# Altium project VENTUNOQ.PrjPcb (part 15 of 18)

## Sheet PCIE_NVME.SchDoc: PCIE_NVME
size A3; Author: Silvio Navaretti; CompanyName: ARDUINO; Organization: ARDUINO; SheetNumber: 27; SheetTotal: 51; RevAuthor: Silvio Navaretti
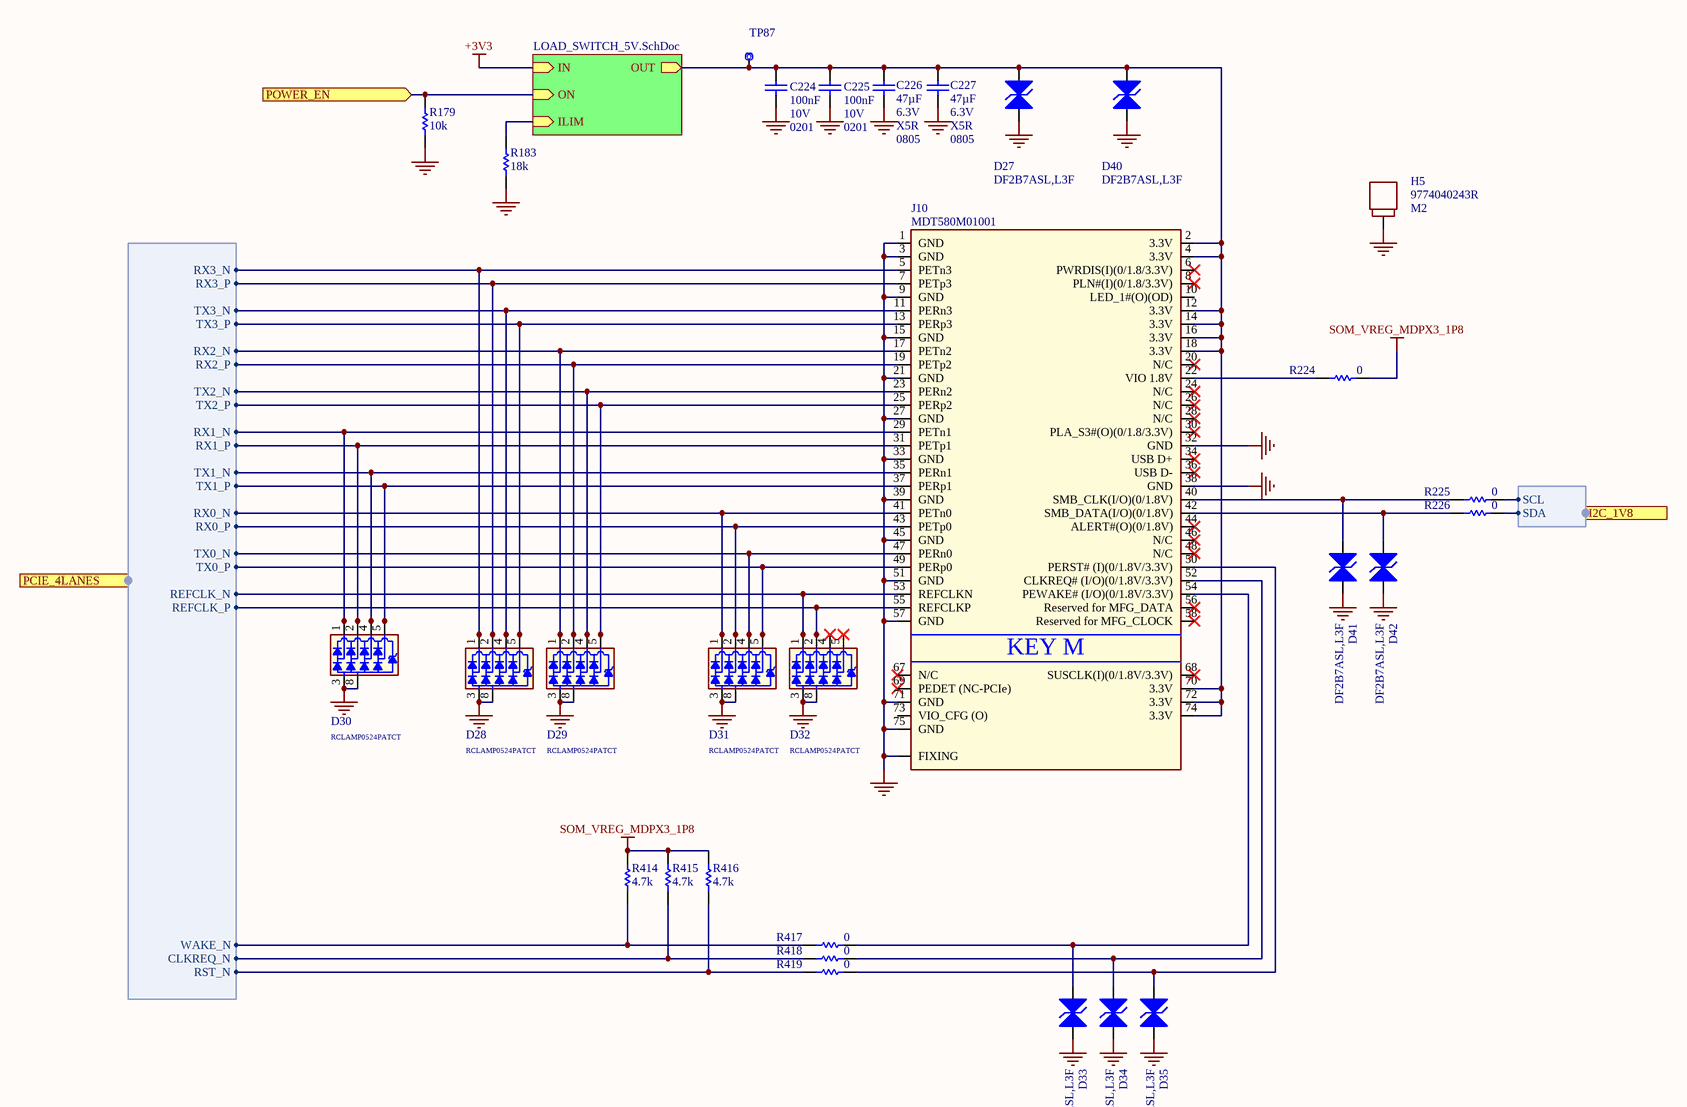
[diagram p48: PCIE_NVME.SchDoc]

### Parts
C224  value 100nF  Voltage: 10V  Case Code (Imperial): 0201  [CAP-0201]  (hidden comment: CL03A104KP3NNNC)
C225  value 100nF  Voltage: 10V  Case Code (Imperial): 0201  [CAP-0201]  (hidden comment: CL03A104KP3NNNC)
C226  value 47µF  Voltage: 6.3V  Dielectric: X5R  Case Code (Imperial): 0805  [CAP-0805]  (hidden comment: C0805C476M9PAC7800)
C227  value 47µF  Voltage: 6.3V  Dielectric: X5R  Case Code (Imperial): 0805  [CAP-0805]  (hidden comment: C0805C476M9PAC7800)
D27  DF2B7ASL,L3F  [DF2B7ASL,L3F]
D28  RCLAMP0524PATCT  [SLP2510P8]
D29  RCLAMP0524PATCT  [SLP2510P8]
D30  RCLAMP0524PATCT  [SLP2510P8]
D31  RCLAMP0524PATCT  [SLP2510P8]
D32  RCLAMP0524PATCT  [SLP2510P8]
D33  DF2B7ASL,L3F  [DF2B7ASL,L3F]
D34  DF2B7ASL,L3F  [DF2B7ASL,L3F]
D35  DF2B7ASL,L3F  [DF2B7ASL,L3F]
D40  DF2B7ASL,L3F  [DF2B7ASL,L3F]
D41  DF2B7ASL,L3F  [DF2B7ASL,L3F]
D42  DF2B7ASL,L3F  [DF2B7ASL,L3F]
H5  9774040243R  [9774040243R]
J10  MDT580M01001  [MDT580M01001]
R179  value 10k  [RES-0201]  (hidden comment: RC0201FR-0710KL)
R183  value 18k  [RES-0201]  (hidden comment: RC0201FR-0718KL)
R224  value 0  [RES-0201]  (hidden comment: CRCW02010000Z0ED)
R225  value 0  [RES-0201]  (hidden comment: CRCW02010000Z0ED)
R226  value 0  [RES-0201]  (hidden comment: CRCW02010000Z0ED)
R414  value 4.7k  [RES-0201]  (hidden comment: RC0201FR-074K7L)
R415  value 4.7k  [RES-0201]  (hidden comment: RC0201FR-074K7L)
R416  value 4.7k  [RES-0201]  (hidden comment: RC0201FR-074K7L)
R417  value 0  [RES-0201]  (hidden comment: CRCW02010000Z0ED)
R418  value 0  [RES-0201]  (hidden comment: CRCW02010000Z0ED)
R419  value 0  [RES-0201]  (hidden comment: CRCW02010000Z0ED)
TP87  Test point 1.00mm  [TP-1.00MM]  (value not drawn)  (no BOM)

### Sub-sheets
U_LOAD_SWITCH_5V = LOAD_SWITCH_5V.SchDoc: IN (in), OUT (out), ON (in), ILIM (in)

### Ports
I2C_1V8 (harness I2C), PCIE_4LANES (in, harness SOM_MD_PCIE1), POWER_EN (in)

### Harnesses
SOM_MD_PCIE1: RX0_N, RX0_P, TX0_P, TX0_N, RX1_N, RX1_P, TX1_P, TX1_N, REFCLK_N, REFCLK_P, RX2_N, RX2_P, TX2_P, TX2_N, RX3_N, RX3_P, TX3_P, TX3_N, WAKE_N, CLKREQ_N, RST_N
I2C: SDA, SCL

### Nets
GND: C224.1 C225.1 C226.1 C227.1 D27.1(A1) D28.3 D28.8 D29.3 D29.8 D30.3 D30.8 D31.3 D31.8 D32.3 D32.8 D33.1(A1) D34.1(A1) D35.1(A1) D40.1(A1) D41.1(A1) D42.1(A1) H5.1 J10.1(GND) J10.3(GND) J10.9(GND) J10.15(GND) J10.21(GND) J10.27(GND) J10.32(GND) J10.33(GND) J10.38(GND) J10.39(GND) J10.45(GND) J10.51(GND) J10.57(GND) J10.71(GND) J10.75(GND) J10.FIXING R179.1 R183.1
SOM_VREG_MDPX3_1P8: R224.1 R414.2 R415.2 R416.2
GPIO_21: R414.1 R417.2 ; port PCIE_4LANES.WAKE_N
GPIO_22: R415.1 R418.2 ; port PCIE_4LANES.CLKREQ_N
GPIO_23: R416.1 R419.2 ; port PCIE_4LANES.RST_N
MD_GPIO_29: R226.1 ; port I2C_1V8.SDA
MD_GPIO_30: R225.1 ; port I2C_1V8.SCL
MD_GPIO_51: R179.2 ; port POWER_EN, sheet U_LOAD_SWITCH_5V/ON
MD_PCIE1_4LANES.REFCLK_N: D32.1 D32.10 J10.53(REFCLKN) ; port PCIE_4LANES.REFCLK_N
MD_PCIE1_4LANES.REFCLK_P: D32.2 D32.9 J10.55(REFCLKP) ; port PCIE_4LANES.REFCLK_P
MD_PCIE1_4LANES.RX0_N: D31.1 D31.10 J10.41(PETn0) ; port PCIE_4LANES.RX0_N
MD_PCIE1_4LANES.RX0_P: D31.2 D31.9 J10.43(PETp0) ; port PCIE_4LANES.RX0_P
MD_PCIE1_4LANES.RX1_N: D30.1 D30.10 J10.29(PETn1) ; port PCIE_4LANES.RX1_N
MD_PCIE1_4LANES.RX1_P: D30.2 D30.9 J10.31(PETp1) ; port PCIE_4LANES.RX1_P
MD_PCIE1_4LANES.RX2_N: D29.1 D29.10 J10.17(PETn2) ; port PCIE_4LANES.RX2_N
MD_PCIE1_4LANES.RX2_P: D29.2 D29.9 J10.19(PETp2) ; port PCIE_4LANES.RX2_P
MD_PCIE1_4LANES.RX3_N: D28.1 D28.10 J10.5(PETn3) ; port PCIE_4LANES.RX3_N
MD_PCIE1_4LANES.RX3_P: D28.2 D28.9 J10.7(PETp3) ; port PCIE_4LANES.RX3_P
MD_PCIE1_4LANES.TX0_N: D31.4 D31.7 J10.47(PERn0) ; port PCIE_4LANES.TX0_N
MD_PCIE1_4LANES.TX0_P: D31.5 D31.6 J10.49(PERp0) ; port PCIE_4LANES.TX0_P
MD_PCIE1_4LANES.TX1_N: D30.4 D30.7 J10.35(PERn1) ; port PCIE_4LANES.TX1_N
MD_PCIE1_4LANES.TX1_P: D30.5 D30.6 J10.37(PERp1) ; port PCIE_4LANES.TX1_P
MD_PCIE1_4LANES.TX2_N: D29.4 D29.7 J10.23(PERn2) ; port PCIE_4LANES.TX2_N
MD_PCIE1_4LANES.TX2_P: D29.5 D29.6 J10.25(PERp2) ; port PCIE_4LANES.TX2_P
MD_PCIE1_4LANES.TX3_N: D28.4 D28.7 J10.11(PERn3) ; port PCIE_4LANES.TX3_N
MD_PCIE1_4LANES.TX3_P: D28.5 D28.6 J10.13(PERp3) ; port PCIE_4LANES.TX3_P
NetC224_2: C224.2 C225.2 C226.2 C227.2 D27.2(A2) D40.2(A2) J10.2(3.3V) J10.4(3.3V) J10.12(3.3V) J10.14(3.3V) J10.16(3.3V) J10.18(3.3V) J10.70(3.3V) J10.72(3.3V) J10.74(3.3V) TP87.X ; sheet U_LOAD_SWITCH_5V/OUT
NetD32_4: D32.4 D32.7
NetD32_5: D32.5 D32.6
NetD33_2: D33.2(A2) J10.54(PEWAKE#_(I/O)(0/1.8V/3.3V)) R417.1
NetD34_2: D34.2(A2) J10.52(CLKREQ#_(I/O)(0/1.8V/3.3V)) R418.1
NetD35_2: D35.2(A2) J10.50(PERST#_(I)(0/1.8V/3.3V)) R419.1
NetD41_2: D41.2(A2) J10.40(SMB_CLK(I/O)(0/1.8V)) R225.2
NetD42_2: D42.2(A2) J10.42(SMB_DATA(I/O)(0/1.8V)) R226.2
NetJ10_22: J10.22(VIO_1.8V) R224.2
NetR183_2: R183.2 ; sheet U_LOAD_SWITCH_5V/ILIM

Not connected (* = marked no-connect by the designer): J10 6(PWRDIS(I)(0/1.8/3.3V))* 8(PLN#(I)(0/1.8/3.3V))* 10(LED_1#(O)(OD)) 20(N/C)* 24(N/C)* 26(N/C)* 28(N/C)* 30(PLA_S3#(O)(0/1.8/3.3V))* 34(USB_D+)* 36(USB_D-)* 44(ALERT#(O)(0/1.8V))* 46(N/C)* 48(N/C)* 56(Reserved_for_MFG_DATA)* 58(Reserved_for_MFG_CLOCK)* 67(N/C)* 68(SUSCLK(I)(0/1.8V/3.3V))* 69(PEDET_(NC-PCIe))* 73(VIO_CFG_(O))

### Notes on the sheet
- Title:
- ID:
- Date:
- Time:
- Version:
- Sheet
- of
- RevAuthor:
- Reference Designs ARE PROVIDED "AS IS" AND "WITH ALL FAULTS. Arduino SA DISCLAIMS ALL OTHER WARRANTIES, EXPRESS OR IMPLIED, REGARDING PRODUCTS, INCLUDING BUT NOT LIMITED TO, ANY IMPLIED WARRANTIES OF MERCHANTABILITY OR FITNESS FOR A PARTICULAR PURPOSE.
  Arduino SA may make changes to specifications and product descriptions at any time, without notice. The Customer must not rely on the absence or characteristics of any features or instructions marked "reserved" or "undefined".
  Arduino SA reserves these for future definition and shall have no responsibility whatsoever for conflicts or incompatibilities arising from future changes to them. The product information on the Web Site or Materials is subject to change without notice.
  Do not finalize a design with this info. ARDUINO and other Arduino brands and logos and Trademarks of Arduino SA. All Arduino SA Trademarks cannot be used without owner's formal permission.
- File:
- Author:
- (in symbol J0573-A.2) KEY M
- (in symbol S0074-A.2) M2

### Library data of the parts
C224 C225 = C0113-A.6: as C305 on sheet HEATSINK_FAN; Technology: Ceramic; Part Number: CL03A104KP3NNNC; Dielectric: X5R; Tolerance: 10%
C226 C227 = C0199-A.1: CAP CHIP 0805 47uF 20% 6.3V X5R; Manufacturer: KEMET; Code Arduino: C0199; Technology: Ceramic; Tolerance: 20%; Part Number: C0805C476M9PAC7800
D27 D33-D35 D40-D42 = D0099-5: as D83-D89 on sheet HEADERS_JMEDIA_JMISC; V(BR) min: 5.8V; V(RWM) max: 5.5V; Part Number: DF2B7ASL,L3F
D28-D32 = D0097-A.6: as D90-D97 on sheet HEADERS_JMEDIA_JMISC; Part Number: RCLAMP0524PATCT
H5 = S0074-A.2: M2 SPACER SMT ROUND STEEL H=4mm; Manufacturer: Wurth Elektronik; Code Arduino: S0074; Part Number: 9774040243R
J10 = J0573-A.2: CONN PCIE-based M.2 NGFF, KEY M, heigth 5.8mm board heigth 4.14mm gold plated, TOP MOUNT; Manufacturer: Amphenol; Code Arduino: J0573; Part Number: MDT580M01001
R179 = R0145-A.21: as R317 on sheet HEADERS_JCTL; Manufacturer 2: Samsung Electro-Mechanics; Tolerance: 1%; Case Code (Imperial): 0201; Part Number: RC0201FR-0710KL; Technology: Thick film
R183 = R0399-A.1: RES CHIP 0201 18k 1% 1/20W; Manufacturer: YAGEO; Power: 50mW; Code Arduino: R0399; Temperature Coefficient: 200ppm; Technology: Thick film; Tolerance: 1%; Case Code (Imperial): 0201; Part Number: RC0201FR-0718KL
R224-R226 R417-R419 = R0140-A.21: as R508 on sheet HEADERS_JMEDIA_JMISC; Technology: Thick film; Case Code (Imperial): 0201; Part Number: CRCW02010000Z0ED
R414-R416 = R0151-A.21: RES CHIP 0201 4k7 1% 1/20W; Manufacturer: Yageo; Temperature coefficient: 200ppm; Power: 50mW; Code Arduino: A5521; Technology: Thick film; Case Code (Imperial): 0201; Part Number: RC0201FR-074K7L; Tolerance: 1%
TP87 = UT0013-A.6: Part Number: This is not a component; Design Item ID: CMP-018-0005-A.3; Source: ut.SchLib; Manufacturer: This is not a component; Code Arduino: This is not a component; Pin Count: 1